# Altium schematic sheet MotorDriverSchm.SchDoc
size A; SheetNumber: 1; SheetTotal: 1
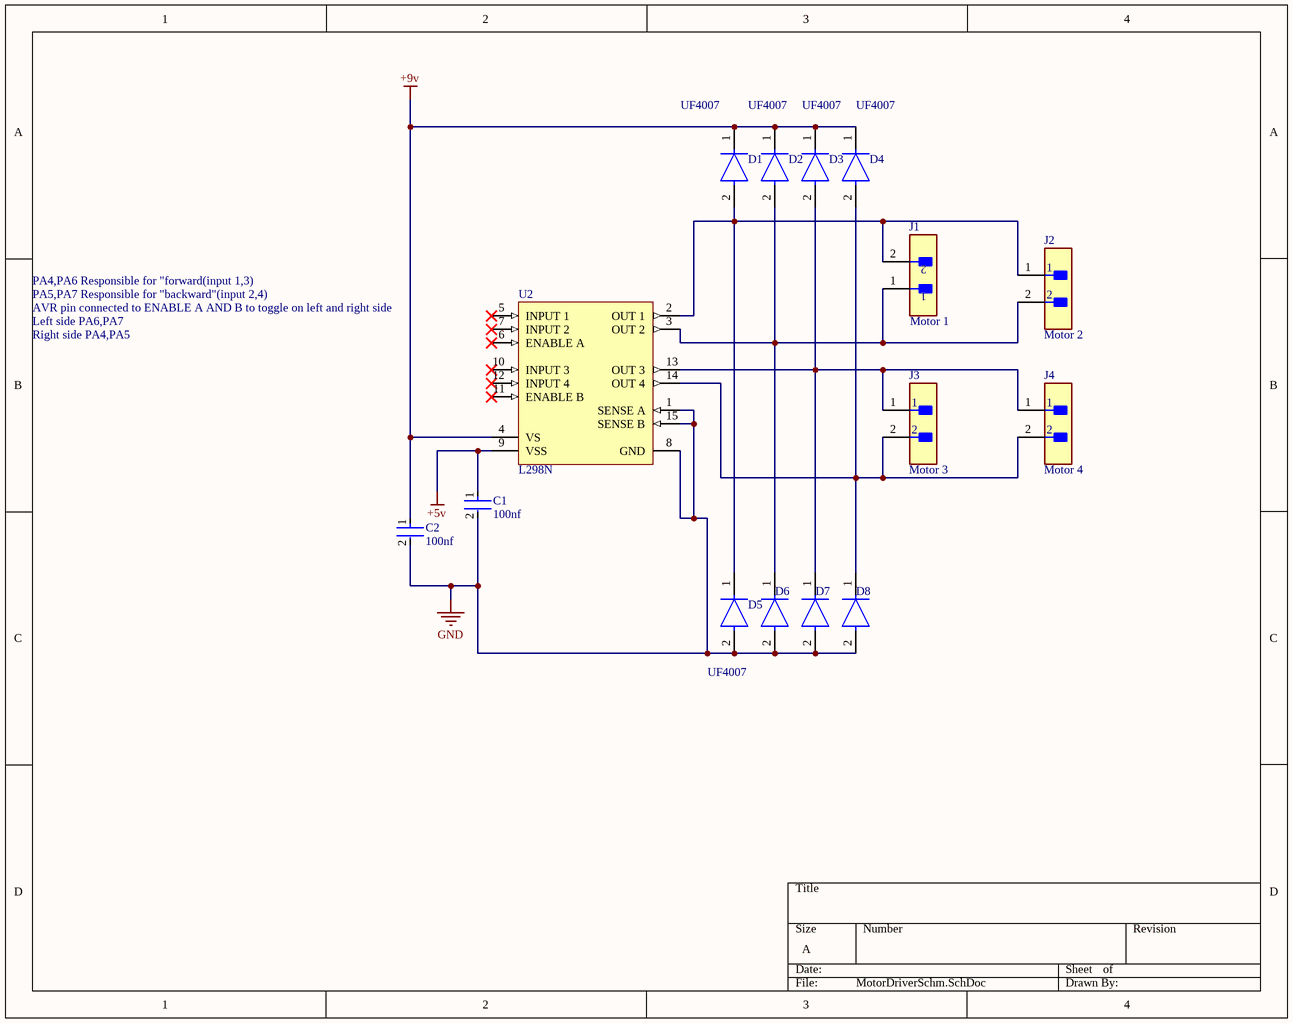
[diagram p0: MotorDriverSchm.SchDoc]

## Parts
C1  100nf  [FP-C0402-BB-MFG]
C2  100nf  [FP-C0402-BB-MFG]
D1  UF4007  [FP-UF4007-MFG]
D2  UF4007  [FP-UF4007-MFG]
D3  UF4007  [FP-UF4007-MFG]
D4  UF4007  [FP-UF4007-MFG]
D5  UF4007  [FP-UF4007-MFG]
D6  (no value)  [FP-UF4007-MFG]
D7  (no value)  [FP-UF4007-MFG]
D8  (no value)  [FP-UF4007-MFG]
J1  Motor 1  [FP-M20-9990246-MFG]
J2  Motor 2  [FP-M20-9990246-MFG]
J3  Motor 3  [FP-M20-9990246-MFG]
J4  Motor 4  [FP-M20-9990246-MFG]
U2  L298N  [STM-FM-15]

## Nets
+5v: C1.1 U2.9(VSS)
+9v: C2.1 D1.1(C) D2.1(C) D3.1(C) D4.1(C) U2.4(VS)
GND: C1.2 C2.2 D5.2(A) D6.2(A) D7.2(A) D8.2(A) U2.1(SENSE_A) U2.8(GND) U2.15(SENSE_B)
NetD1_2: D1.2(A) D5.1(C) J1.2 J2.1 U2.2(OUT_1)
NetD2_2: D2.2(A) D6.1(C) J1.1 J2.2 U2.3(OUT_2)
NetD3_2: D3.2(A) D7.1(C) J3.1 J4.1 U2.13(OUT_3)
NetD4_2: D4.2(A) D8.1(C) J3.2 J4.2 U2.14(OUT_4)

Not connected (* = marked no-connect by the designer): U2 5(INPUT_1)* 6(ENABLE_A)* 7(INPUT_2)* 10(INPUT_3)* 11(ENABLE_B)* 12(INPUT_4)*

## Notes on the sheet
- PA4,PA6 Responsible for "forward(input 1,3)
- PA5,PA7 Responsible for "backward"(input 2,4)
- AVR pin connected to ENABLE A AND B to toggle on left and right side
- Right side PA4,PA5
- Left side PA6,PA7

## Library data of the parts
C1 C2 = CMP-2008-02046-2: CAP CER 0.1UF 10V X5R 0402; Manufacturer: Kemet; Manufacturer Part Number: C0402C104K8PACTU; Material: Ceramic; Capacitance: 0.10 μF; Temperature Coefficient: 15%; Description: C0402 0.10 μF X5R 10.00% 10 V; Tolerance: 0.1; Value: 0.10 μF; Package: C0402-BB; Temperature: -55°C to +125°C; ComponentLink2Description: Datasheet; Temperature Characteristic: X5R; Device Class L1: Passive Components; Height: 0.55mm; Lead Free: Yes; ComponentLink2URL: https://content.kemet.com/datasheets/KEM_C1002_X7R_SMD.pdf; Device Class L2: Capacitors; Temperature Range Low: -55°C; Temperature Range High: +125°C; RoHS: TRUE; Octopart: https://octopart.com/c0402c104k8pactu-kemet-140039; Automotive: No; Mouser Description: Capacitor 100 nF 10 VDC 0402; Category: Cap; Voltage Rating: 10 V; Digikey Description: CAP CER 0.1UF 10V X5R 0402; Ipc Land Pattern Name: CAPC10050X50; Device Class L3: Ceramic Capacitors
D1-D8 = CMP-02540-000043-1: DIODE GEN PURP 1KV 1A DO204AL; Manufacturer: Vishay; Manufacturer Part Number: UF4007-E3/54; Max Junction Temp: +150°C; Max Repetitive Reverse Voltage: 1000V; Max Surge Forward Current: 30A; Capacitance: 17pF; Peak Reverse Current: 10uA; Value: 17pF; Description: Diode Standard 1000V 1A Through Hole DO-204AL (DO-41); Package: UF4007; Height: 2.7mm; RoHS: TRUE; Device Class L3: Rectifier Diodes; Temperature Range Low: -55°C; Ipc Land Pattern Name: DIOPA1088W105L520D270; Temperature: -55°C to +150°C; Category: Diode; Device Class L2: Diodes; Device Class L1: Discrete Semiconductors; Digikey Description: DIODE GEN PURP 1KV 1A DO204AL; Octopart: https://octopart.com/uf4007-e3%2F54-vishay-42333894; Mouser Description: Rectifiers Vr/1000V Io/1A; ComponentLink2URL: http://www.vishay.com/docs/88755/uf4001.pdf; Lead Free: Yes; Temperature Range High: +150°C; Automotive: No; ComponentLink2Description: Datasheet; Forward Current: 1A
J1-J4 = CMP-15831-000009-1: CONN HEADER VERT 2POS 2.54MM; Manufacturer: Harwin; Manufacturer Part Number: M20-9990246; Conn Gender: Male; Description: Connector Header Through Hole 2 position 0.100" (2.54mm); Conn Orientation: Vertical; Number Of Contacts: 2; Current Rating: 3A; ComponentLink2URL: https://cdn.harwin.com/pdfs/M20-999.pdf; ComponentLink2Description: Datasheet; Package: M20-9990246; Temperature: -40°C to +105°C; Octopart: https://octopart.com/m20-9990246-harwin-2590635; Mouser Description: 2.54mm (0.1") Pitch SIL Vertical PC Tail Pin Header, 6.1mm mating pin height, tin, 2 contacts; Temperature Range High: +105°C; Device Class L1: Connectors; RoHS: TRUE; Automotive: No; Height: 8.99mm; Number Of Rows: 1; Contact Material: Tin,Nickel; Category: Conn; Pitch: 2.54mm; Lead Free: Yes; Digikey Description: CONN HEADER VERT 2POS 2.54MM; Temperature Range Low: -40°C; Device Class L3: unset; Device Class L2: Headers and Wire Housings
U2 = CMP-2000-06526-1: Dual Full-Bridge Driver, 4.8 to 46 V, -40 to 150 degC, 15-Pin FM (MW 15L), RoHS, Tube; Manufacturer: STMicroelectronics; PartNumber: L298; Output Current: 2A; Supply Voltage Max: 7V; Driver Case Style: Multiwatt; Supply Voltage Min: 4.5V; No. of Pins: 15Pins; SVHC: NoSVHC(17-Dec-2015); Output Voltage: 46V; No. of Outputs: 4Outputs; Motor Type: FullBridge; MSL: -; Package Description: 15-Pin Flange Mount, Body 5 x 19.6 mm, Pitch 1.27 mm; Datasheet Version: 01/2000; Package Reference: FM-15; Mounting Technology: ThroughHole; Packaging: Each; Automotive Qualification Standard: -; Product Range: -; Datasheet URL: https://datasheet.ciiva.com/15109/getdatasheetpartid-50682-15109332.pdf; Operating Temperature Max: 130°C; Operating Temperature Min: -25°C; Manufacturer URL: http://www.st.com/